# EAGLE design atxpd (EAGLE 6.5.0)
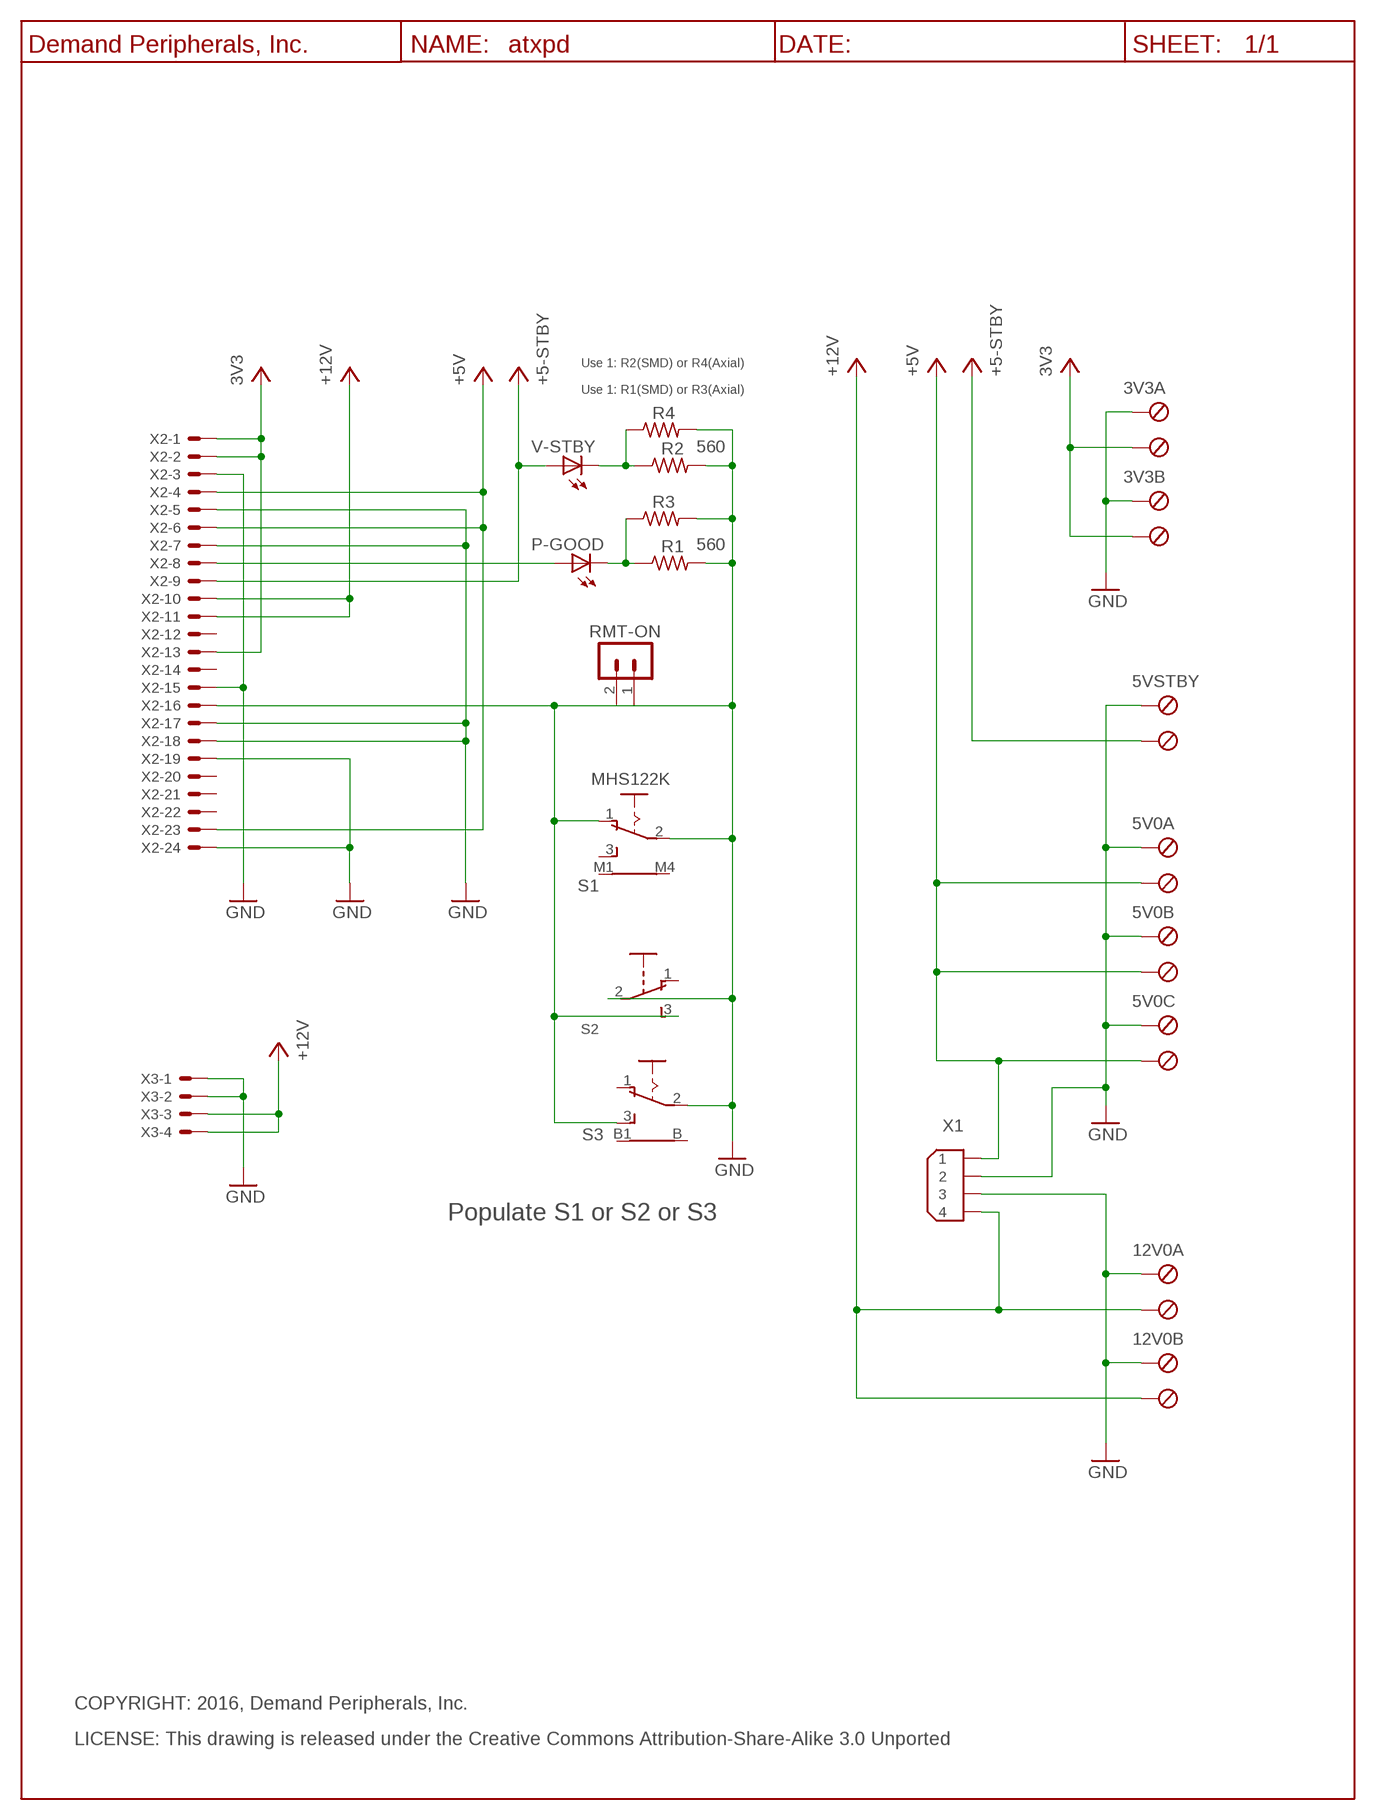
[diagram p0: schematic, sheet 1]

## Parts
3V3A  TBLK-5.08-X2  [TBLK-5.08-X2]
3V3B  TBLK-5.08-X2  [TBLK-5.08-X2]
5V0A  TBLK-5.08-X2  [TBLK-5.08-X2]
5V0B  TBLK-5.08-X2  [TBLK-5.08-X2]
5V0C  TBLK-5.08-X2  [TBLK-5.08-X2]
5VSTBY  TBLK-5.08-X2  [TBLK-5.08-X2]
12V0A  TBLK-5.08-X2  [TBLK-5.08-X2]
12V0B  TBLK-5.08-X2  [TBLK-5.08-X2]
P-GOOD  3mm_LED  LED-5MM-RED  [LED5MM]
R1  560  R560_R0603  [R0603]
R2  560  R560_R0603  [R0603]
R3  560  R560_  [R4TENTHS]
R4  560  R560_  [R4TENTHS]
RMT-ON  PinHdr254-2  HDR-2X1-LCK  [HDR-2X1]
S1  MHS122K  [MHS122K]
S2  TINYTOGGLE-SPDT-TH  [SPDT-TENTHINCH]
S3  Vert_SW(Option)  TOGGLE_SPDT_PC  [TOGGLE_SPDT_PC]
U$1  DP_FRAME_P  [LETTER_P]
V-STBY  3mm_LED  LED-5MM-GRN  [LED5MM]
X1  9090-4V  [9090-4V]
X2  ATX_Std  5566-24MOD  [5566-24MOD]
X3  ATX_Plus4  5566-4MOD  [5566-4MOD]

## Nets
+3,3V: 3V3A.2(KL1) 3V3B.2(KL1) X2.1 X2.2 X2.13 ; supply symbol labelled 3V3
+5V: 5V0A.2(KL1) 5V0B.2(KL1) 5V0C.2(KL1) X1.1 X2.4 X2.6 X2.23
+5V/1: 5VSTBY.2(KL1) V-STBY.A X2.9 ; supply symbol labelled +5-STBY
+5V/2: 12V0A.2(KL1) 12V0B.2(KL1) X1.4 X2.10 X2.11 X3.3 X3.4 ; supply symbol labelled +12V
GND: 3V3A.1(KL) 3V3B.1(KL) 5V0A.1(KL) 5V0B.1(KL) 5V0C.1(KL) 5VSTBY.1(KL) 12V0A.1(KL) 12V0B.1(KL) R1.2 R2.2 R3.2 R4.2 RMT-ON.2 S1.2(P) S2.2 S3.2(P) X1.2 X1.3 X2.3 X2.5 X2.7 X2.15 X2.17 X2.18 X2.19 X2.24 X3.1 X3.2
N$4: P-GOOD.A X2.8
N$5: P-GOOD.C R1.1 R3.1
N$6: R2.1 R4.1 V-STBY.C
N$7: RMT-ON.1 S1.1(O) S2.3 S3.3(S) X2.16
Unconnected: S1.3(S) S1.M1(B1) S1.M4(B) S2.1 S3.1(O) S3.B S3.B1 X2.12 X2.14 X2.20 X2.21 X2.22

## Notes on the sheet
- Use 1: R2(SMD) or R4(Axial)
- Use 1: R1(SMD) or R3(Axial)
- Populate S1 or S2 or S3
- COPYRIGHT: 2016, Demand Peripherals, Inc.
- LICENSE: This drawing is released under the Creative Commons Attribution-Share-Alike 3.0 Unported

## Library data of the parts
3V3A 3V3B 5V0A 5V0B 5V0C 5VSTBY 12V0A 12V0B = dpi-conn:TBLK-5.08-X2: Terminal Block, 5.08mm, x2, screw terminals; VENDOR: Digikey; VENDOR-PART-NUM: ED2609-ND
P-GOOD = dpi-diopto:LED-5MM-RED: Red LED, 5 MM, through-hole; VENDOR: Digikey; VENDOR-PART-NUM: 160-1853-ND
R1 R2 = dpi-passive:R560_: 560 Ohm resistor, 1%, 0.1 watt; VENDOR: Digikey; VENDOR-PART-NUM: 311-560HRTR-ND
R3 R4 = dpi-passive:R560_: 560 Ohm resistor, 1%, 0.1 watt; VENDOR: Digikey; VENDOR-PART-NUM: CF18JT560RCT-ND
RMT-ON = dpi-conn:HDR-2X1-LCK: 2x1 pin header with friction lock; VENDOR: Mouser; VENDOR-PART-NUM: 571-6404562
S1 = dpi-swsens:MHS122K: SPDT SLIDE SWITCH; VENDOR: Digikey; VENDOR-PART-NUM: 679-1866-ND
S2 = dpi-swsens:TINYTOGGLE-SPDT-TH: SPDT Toggle switch with 0.1 inch centers; VENDOR: Digikey; VENDOR-PART-NUM: EG2459-ND
S3 = dpi-swsens:TOGGLE_SPDT_PC: SPDT TOGGLE SWITCH; VENDOR: Digikey; VENDOR-PART-NUM: CKN1454-ND
U$1 = DP:DP_FRAME_P: Portrait/Letter Document Frame
V-STBY = dpi-diopto:LED-5MM-GRN: Green LED, 5 MM, through-hole; VENDOR: Digikey; VENDOR-PART-NUM: 160-1852-ND
X1 = dpi-conn:9090-4: Disk Drive Power, 4 position; VENDOR: Mouser; VENDOR-PART-NUM: 538-15-24-4449
X2 = dpi-conn:5566-24: Mini FIT connector 24 pol Source: http://www.molex.com; VENDOR: Digikey; VENDOR-PART-NUM: WM9738-ND
X3 = dpi-conn:5566-4: Molex Mini FIT connector 4 pol; VENDOR: Digikey; VENDOR-PART-NUM: A30669-ND

## Board
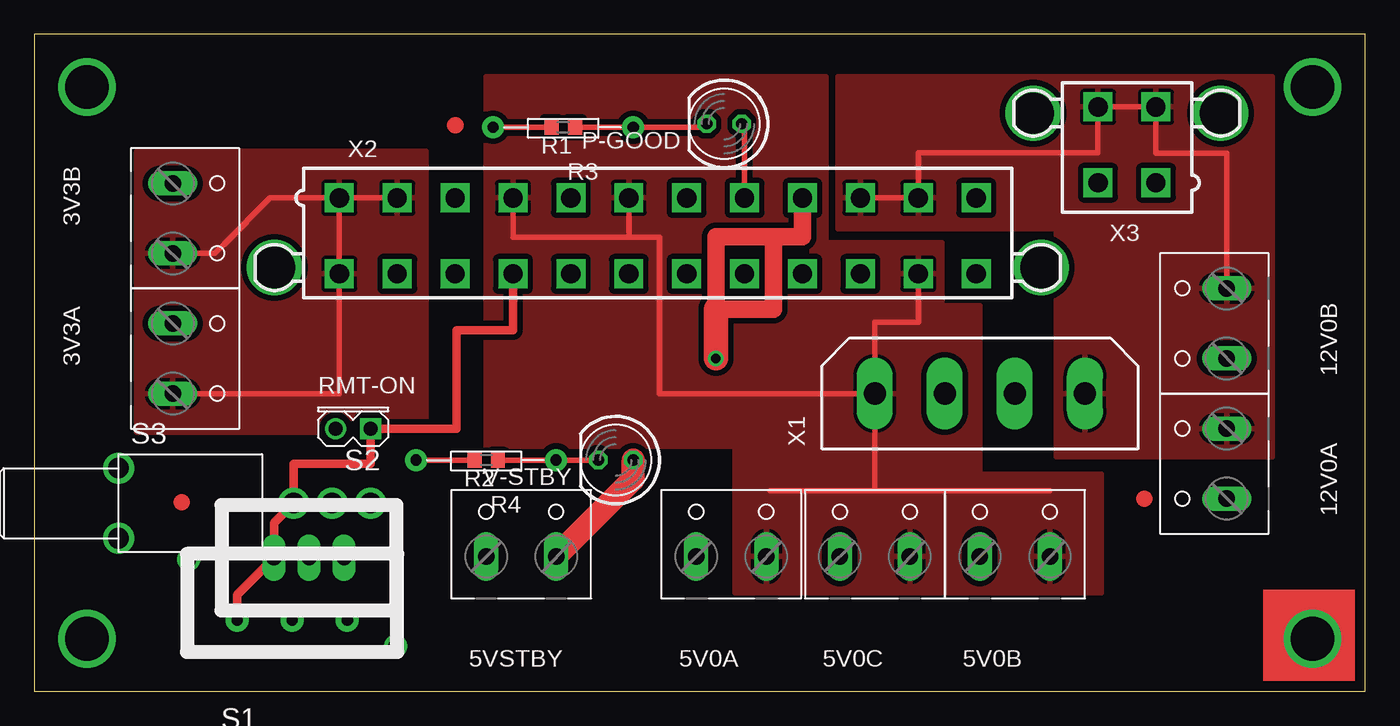
[diagram p1: board, top side]
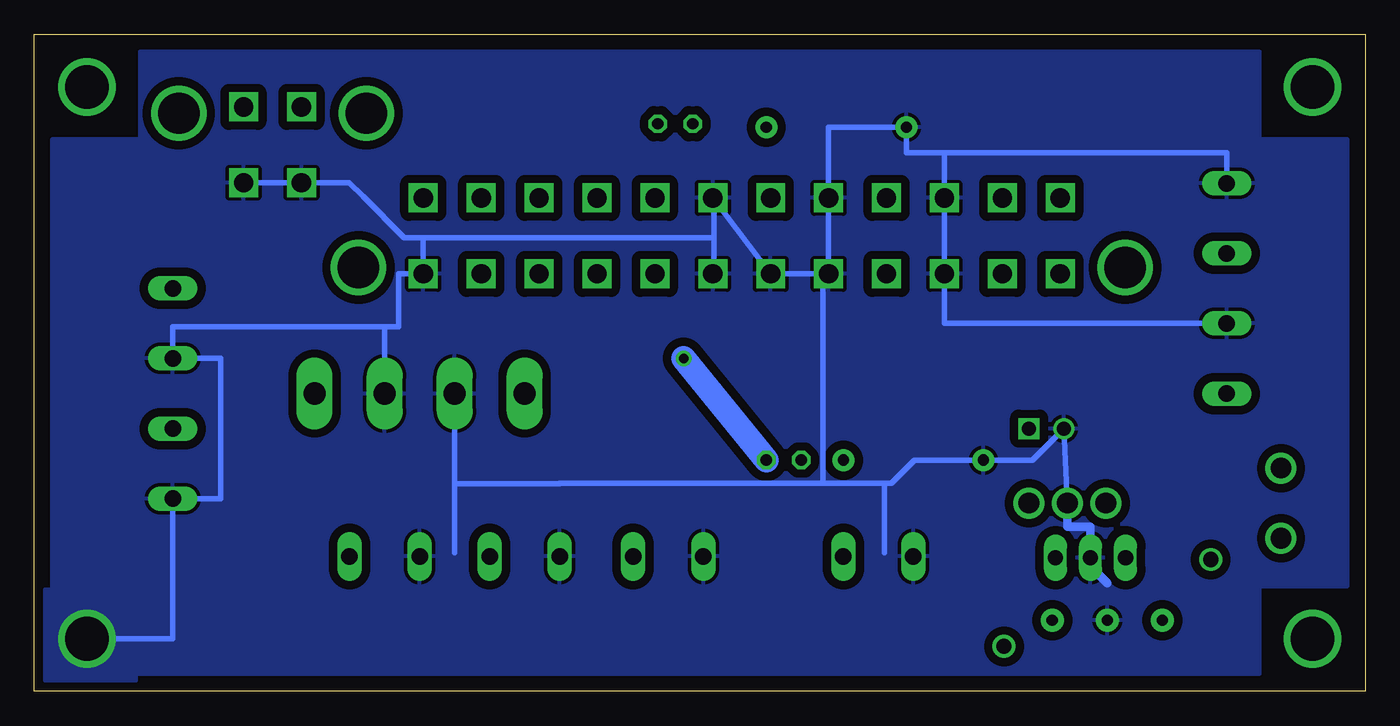
[diagram p2: board, bottom side, seen from below]

Size 96.52 x 47.62 mm. Coordinates in mm from the lower left corner, seen from the top.
Outline: 0,0 96.52,0 96.52,47.62 0,47.62 0,0
Copper layers (1*16): Top 0.035mm / dielectric 1.5mm / Bottom 0.035mm
Design rules "default *": minimum track width 10mil, minimum drill 24mil, track to track 8mil, track to pad 8mil, pad to pad 8mil, via to via 8mil, smd to smd 8mil, copper to edge 20mil, drill to drill 8mil, minimum pad ring 10mil, minimum via ring 8mil, stop-mask expansion 4mil, vias tented up to drill 0mil, thermal gap 10mil

### Footprints (pad centres in the part's own frame; a part is rotated, then mirrored left to right if it is on the bottom)
TBLK-5.08-X2 = drill 1.194 long: 1 -2.54,-0.127; 2 2.54,-0.127
LED5MM = drill 0.813 octagon: A -1.27,0; C 1.27,0
R0603 = smd 1 x 1.1: 1 -0.85,0; 2 0.85,0
R4TENTHS = drill 0.813 pad 1.6: 1 -5.08,0; 2 5.08,0
HDR-2X1 = drill 1.016 square: 1 1.27,0 | drill 1.016: 2 -1.27,0
MHS122K = drill 0.813 pad 1.676: 1 4,0; 2 0,0; 3 -4,0 | drill 1.1: M1 -7.5,1.9; M4 7.5,-4.4
SPDT-TENTHINCH = drill 1.1 pad 1.676 long: 1 2.54,0; 2 0,0; 3 -2.54,0
TOGGLE_SPDT_PC = drill 1.5 pad 1.676: 1 18.288,0; 2 15.494,0; 3 12.7,0 | drill 1.5 pad 1.778: B 0,-2.54; B1 0,2.54
9090-4V = drill 1.6 pad 2.6 long: 1 -7.62,0; 2 -2.54,0; 3 2.54,0; 4 7.62,0
5566-24MOD = drill 1.4 square: 1 23.1,-2.75; 2 18.9,-2.75; 3 14.7,-2.75; 4 10.5,-2.75; 5 6.3,-2.75; 6 2.1,-2.75; 7 -2.1,-2.75; 8 -6.3,-2.75; 9 -10.5,-2.75; 10 -14.7,-2.75; 11 -18.9,-2.75; 12 -23.1,-2.75; 13 23.1,2.75; 14 18.9,2.75; 15 14.7,2.75; 16 10.5,2.75; 17 6.3,2.75; 18 2.1,2.75; 19 -2.1,2.75; 20 -6.3,2.75; 21 -10.5,2.75; 22 -14.7,2.75; 23 -18.9,2.75; 24 -23.1,2.75 | drill 3 pad 3.508: P$1 -27.8,2.29; P$2 27.8,2.29
5566-4MOD = drill 1.4 square: 1 2.1,-2.75; 2 -2.1,-2.75; 3 2.1,2.75; 4 -2.1,2.75 | drill 3 pad 3.508: P$1 -6.8,2.29; P$2 6.8,2.29

### Placement (x,y rotation side)
3V3A  10.16,24.13 270 top
3V3B  10.16,34.29 270 top
5V0A  50.55,9.91 0 top
5V0B  71.12,9.91 0 top
5V0C  60.96,9.91 0 top
5VSTBY  35.31,9.91 0 top
12V0A  86.36,16.51 90 top
12V0B  86.36,26.67 90 top
P-GOOD  50.04,41.15 180 top
R1  38.35,40.89 180 top
R2  32.77,16.76 180 top
R3  38.35,40.89 180 top
R4  32.77,16.76 180 top
RMT-ON  23.11,19.05 0 top
S1  18.69,5.16 180 top
S2  19.91,9.68 0 top
S3  6.1,13.64 0 top
U$1  0,0 0 top
U$9  [FIDUCIAL]  30.53,41.05 0 top
U$10  [FIDUCIAL]  10.67,13.72 0 top
U$11  [FIDUCIAL]  80.52,13.97 0 top
V-STBY  42.16,16.76 180 top
X1  68.58,21.59 0 top
X2  45.21,33.02 180 top
X3  79.25,39.62 0 top

### Tracks (layer width: path | path; a pad name or v marks a point on that pad's centre or on a via)
+3,3V
  Top 0.406: X2.1 X2.2 | X2.1 X2.13 22.11,21.59 3V3A.2 | X2.1 17.1,35.77 13.75,32.42 13.08,31.75 3V3B.2
  pour Top (isolate 0.406): 7.42,39.17 28.42,39.17 28.42,18.8 7.42,18.8
+5V
  Top 0.406: X2.4 34.71,32.92 43.13,32.92 | 43.13,32.92 X2.6 | 43.13,32.92 45.34,32.92 45.34,21.59 X1.1 | 61.04,14.54 61,14.54 | 61.04,14.54 63.55,14.54 | 63.55,14.54 71.34,14.54 73.66,14.54 | 53.34,14.54 61.04,14.54 | 63.55,14.54 63.5,14.54 | X2.23 64.11,26.76 63.37,26.76 60.96,26.76 X1.1 | 61.04,14.54 60.96,14.54 X1.1
  pour Top (isolate 0.406): 77.39,15.72 68.58,15.72 68.58,27.94 65.81,27.94 65.81,32.51 57.43,32.51 57.43,44.58 32.77,44.58 32.77,17.78 50.8,17.78 50.8,7.14 77.39,7.14
+5V/1  (via drill 0.7)
  Top 1.27: 53.62,32.94 49.43,32.94 49.43,27.71 53.62,27.71 53.62,32.94 | 53.62,32.94 55.71,32.94 X2.9
  Top 1.676: V-STBY.A 43.43,15.62 43.43,15.37 5VSTBY.2
  Top 1.778: v49.43,24.13 49.43,27.71
  Bottom 1.778: V-STBY.A v49.43,24.13
+5V/2
  Top 0.406: 12V0B.2 86.49,37.23 86.49,39 85.47,39 81.35,39 X3.3 X3.4 77.15,39.06 73.84,39.06 67.41,39.06 64.11,39.06 X2.11 X2.10
  pour Top (isolate 0.406): 89.79,17.02 74.14,17.02 74.14,33.53 58.29,33.53 58.29,44.58 89.79,44.58
GND  (via drill 3.17 pad 3.17)
  Top 0.406: R3.2 R1.2 | R4.2 R2.2
  Bottom 0.406: 38.91,35.64 X2.17 39.08,30.27 | 38.91,35.64 X2.5 | 39.31,30.27 39.08,30.27 | 39.31,30.27 X2.18 47.24,35.68 | 47.24,35.68 X2.7 | X3.1 X3.2 73.68,36.87 72.69,35.89 69.7,32.89 68.31,32.89 | 68.31,32.89 49.94,32.89 47.24,32.89 | S3.2 RMT-ON.2 24.13,16.76 R4.2 32.68,16.76 34.34,15.1 34.85,15.1 | 3V3A.1 26.91,26.67 30.51,26.67 X2.15 X2.3 30.51,39.06 | 3V3B.1 10.03,39.06 29.26,39.06 30.51,39.06 | 34.85,15.1 39.31,15.09 | 39.31,15.09 48.26,15.07 58.42,15.07 | 39.31,15.09 39.31,30.27 | 66.04,15.06 66.04,12.57 66.04,10.03 | 66.04,15.06 X1.2 | 58.42,15.06 66.04,15.06 | 34.85,15.1 34.85,10.03 | 71.12,26.44 70.1,26.44 70.1,30.27 X2.24 68.31,32.89 | 71.12,26.44 X1.3 | v92.71,3.81 86.49,3.81 12V0A.1 83.01,13.97 83.01,17.45 83.01,20.65 83.01,23.47 83.01,24.13 12V0B.1 86.49,26.44 71.12,26.44 | 47.24,35.68 47.24,32.89 | X2.19 47.24,30.27 47.24,32.89 | 38.91,35.64 38.91,40.89 R3.2 33.27,39.06 30.51,39.06 | 39.31,30.27 39.08,30.27
  Bottom 0.61: 18.69,7.85 19.91,9.07 S2.2 19.91,11.94 21.51,11.94 21.59,11.94 S3.2
  pour Bottom (isolate 0.61): 95.25,40.02 95.25,7.37 95.76,7.37 95.76,0.77 89.15,0.77 89.15,1.27 7.62,1.27 7.62,7.62 1.27,7.62 1.27,40.02 7.62,40.02 7.62,46.37 88.9,46.37 88.9,40.02
MOUNT0  (via drill 3.17 pad 3.17)
  other vias: 3.81,3.81
MOUNT1  (via drill 3.17 pad 3.17)
  other vias: 3.81,43.81
MOUNT7  (via drill 3.17 pad 3.17)
  other vias: 92.71,43.81
N$4
  Top 0.406: P-GOOD.A 51.51,40.69 X2.8
N$5
  Top 0.406: R3.1 R1.1 48.77,40.89 P-GOOD.C
N$6
  Top 0.406: R2.1 R4.1 V-STBY.C
N$7
  Top 0.61: X2.16 34.71,26.16 30.61,26.16 30.61,19.05 RMT-ON.1 24.38,16.51 19.81,16.51 18.8,16.51 S3.3 17.37,12.22 S2.3 14.69,7 S1.1
(copper drawn outside any net)
  shapes: Top area x1

### Text on the board
tTest: 3.8 Inches | 3.5 Inches | (C) 2017, Demand Peripherals, Inc. | ATXPD, Rev 17A | R1 | Power Good | R3 | 13 | 3.3V | 12V | 3.3V | RMT-ON | R2 | 12V | Standby | R4 | 1.575 Inches | 1.875 Inches | S3 | S2 | S1 | 5-STBY | 5V | 5V | 5V | On / Off